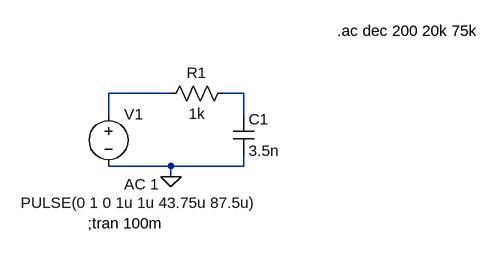
[diagram p0: schematic Draft2.asc]
Draft2.asc, the LTspice schematic file:
Version 4
SHEET 1 880 680
WIRE 112 80 16 80
WIRE 224 80 192 80
WIRE 16 112 16 80
WIRE 224 112 224 80
WIRE 112 192 16 192
WIRE 224 192 224 176
WIRE 224 192 112 192
WIRE 112 208 112 192
FLAG 112 208 0
SYMBOL voltage 16 96 R0
WINDOW 123 24 124 Left 2
WINDOW 39 0 0 Left 2
WINDOW 3 -135 152 Left 2
SYMATTR Value2 AC 1
SYMATTR Value PULSE(0 1 0 1u 1u 43.75u 87.5u)
SYMATTR InstName V1
SYMBOL res 208 64 R90
WINDOW 0 0 56 VBottom 2
WINDOW 3 32 56 VTop 2
SYMATTR InstName R1
SYMATTR Value 1k
SYMBOL cap 208 112 R0
SYMATTR InstName C1
SYMATTR Value 3.5n
TEXT -16 280 Left 2 !;tran 100m
TEXT 368 -16 Left 2 !.ac dec 200 20k 75k

The netlist it stands for:
* Draft2.asc
V1 N001 0 PULSE(0 1 0 1u 1u 43.75u 87.5u) AC 1
R1 N002 N001 1k
C1 N002 0 3.5n
;tran 100m
.ac dec 200 20k 75k
.backanno
.end